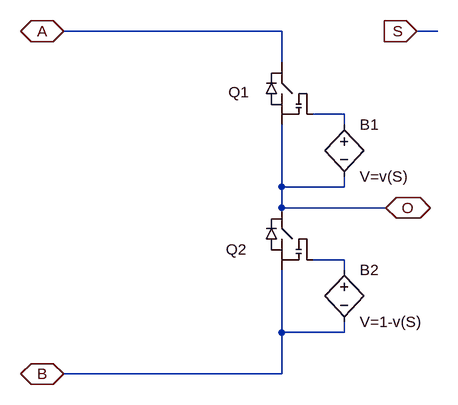
[diagram p0: schematic 2L_switching_model.asc]
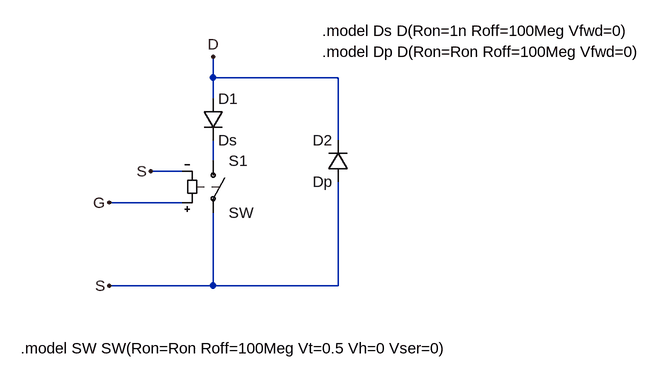
[diagram p1: sub-circuit isw.asc]
2L_switching_model.asc, the LTspice schematic file:
Version 4
SHEET 1 880 680
WIRE 448 96 112 96
WIRE 688 96 656 96
WIRE 448 144 448 96
WIRE 544 224 496 224
WIRE 544 240 544 224
WIRE 448 336 448 240
WIRE 544 336 544 320
WIRE 544 336 448 336
WIRE 448 368 448 336
WIRE 608 368 448 368
WIRE 544 448 496 448
WIRE 544 464 544 448
WIRE 448 560 448 464
WIRE 544 560 544 544
WIRE 544 560 448 560
WIRE 448 624 448 560
WIRE 448 624 112 624
FLAG 608 368 O
IOPIN 608 368 BiDir
FLAG 112 96 A
IOPIN 112 96 BiDir
FLAG 112 624 B
IOPIN 112 624 BiDir
FLAG 656 96 S
IOPIN 656 96 In
SYMBOL bv 544 224 R0
SYMATTR InstName B1
SYMATTR Value V=v(S)
SYMBOL bv 544 448 R0
SYMATTR InstName B2
SYMATTR Value V=1-v(S)
SYMBOL iSW 448 208 M0
WINDOW 0 50 -18 Left 2
SYMATTR InstName Q1
SYMATTR SpiceLine Ron=Rsw
SYMBOL iSW 448 432 M0
WINDOW 0 54 0 Left 2
SYMATTR InstName Q2
SYMATTR SpiceLine Ron=Rsw

isw.asc, the sub-circuit schematic file:
Version 4
SHEET 1 880 680
WIRE 160 -32 160 -64
WIRE 352 -32 160 -32
WIRE 160 0 160 -32
WIRE 352 64 352 -32
WIRE 160 96 160 64
WIRE 112 112 64 112
WIRE 112 160 0 160
WIRE 160 288 0 288
WIRE 160 288 160 176
WIRE 352 288 352 128
WIRE 352 288 160 288
FLAG 0 160 G
FLAG 0 288 S
FLAG 160 -64 D
FLAG 64 112 S
SYMBOL sw 160 80 R0
SYMATTR InstName S1
SYMBOL diode 144 0 R0
SYMATTR InstName D1
SYMATTR Value Ds
SYMBOL diode 368 128 R180
WINDOW 0 24 64 Left 2
WINDOW 3 24 0 Left 2
SYMATTR InstName D2
SYMATTR Value Dp
TEXT -136 384 Left 2 !.model SW SW(Ron=Ron Roff=100Meg Vt=0.5 Vh=0 Vser=0)
TEXT 328 -104 Left 2 !.model Ds D(Ron=1n Roff=100Meg Vfwd=0)
TEXT 328 -72 Left 2 !.model Dp D(Ron=Ron Roff=100Meg Vfwd=0)

The netlist it stands for:
* 2L_switching_model.asc
B1 N001 O V=v(S)
B2 N002 B V=1-v(S)
XQ1 A O N001 isw params: Ron=Rsw
XQ2 O B N002 isw params: Ron=Rsw

* block symbol definitions
.subckt isw D S G
S1 N001 S G S SW
D1 D N001 Ds
D2 S D Dp
.model SW SW(Ron=Ron Roff=100Meg Vt=0.5 Vh=0 Vser=0)
.model Ds D(Ron=1n Roff=100Meg Vfwd=0)
.model Dp D(Ron=Ron Roff=100Meg Vfwd=0)
.ends isw

.model D D
.lib standard.dio
.backanno
.end